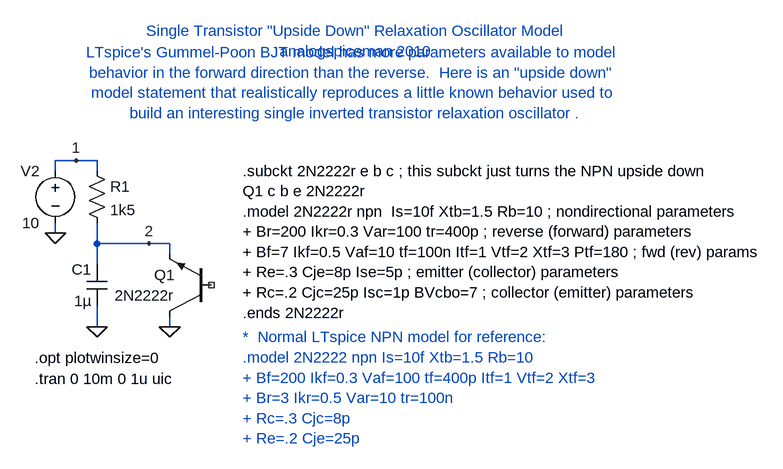
[diagram p0: schematic UpsideDown.asc]
UpsideDown.asc, the LTspice schematic file:
Version 4
SHEET 1 1064 680
WIRE -96 -384 -128 -384
WIRE -64 -384 -96 -384
WIRE -128 -368 -128 -384
WIRE -64 -368 -64 -384
WIRE -128 -272 -128 -288
WIRE -64 -256 -64 -288
WIRE 16 -256 -64 -256
WIRE 48 -256 16 -256
WIRE 48 -240 48 -256
WIRE -64 -224 -64 -256
WIRE -64 -128 -64 -160
WIRE 48 -128 48 -144
FLAG 48 -128 0
FLAG -64 -128 0
FLAG -128 -272 0
FLAG -96 -384 1
FLAG 16 -256 2
SYMBOL npn 112 -144 R180
WINDOW 0 56 64 Left 0
WINDOW 3 56 32 Left 0
SYMATTR InstName Q1
SYMATTR Value 2N2222r
SYMATTR Prefix X
SYMBOL res -80 -384 R0
SYMATTR InstName R1
SYMATTR Value 1k5
SYMBOL cap -48 -224 M0
SYMATTR InstName C1
SYMATTR Value 1µ
SYMATTR SpiceLine V=50 Irms=0 Rser=0.008 Lser=0 mfg="TDK" pn="C3225X7RlHlO5M" type="X7R"
SYMBOL voltage -128 -384 M0
WINDOW 123 0 0 Left 0
WINDOW 39 0 0 Left 0
SYMATTR InstName V2
SYMATTR Value 10
TEXT -160 -80 Left 0 !.opt plotwinsize=0
TEXT -160 -48 Left 0 !.tran 0 10m 0 1u uic
TEXT 160 -112 Left 0 ;*  Normal LTspice NPN model for reference:\n.model 2N2222 npn Is=10f Xtb=1.5 Rb=10\n+ Bf=200 Ikf=0.3 Vaf=100 tf=400p Itf=1 Vtf=2 Xtf=3\n+ Br=3 Ikr=0.5 Var=10 tr=100n\n+ Rc=.3 Cjc=8p\n+ Re=.2 Cje=25p
TEXT 160 -368 Left 0 !.subckt 2N2222r e b c ; this subckt just turns the NPN upside down\nQ1 c b e 2N2222r\n.model 2N2222r npn  Is=10f Xtb=1.5 Rb=10 ; nondirectional parameters\n+ Br=200 Ikr=0.3 Var=100 tr=400p ; reverse (forward) parameters\n+ Bf=7 Ikf=0.5 Vaf=10 tf=100n Itf=1 Vtf=2 Xtf=3 Ptf=180 ; fwd (rev) params\n+ Re=.3 Cje=8p Ise=5p ; emitter (collector) parameters\n+ Rc=.2 Cjc=25p Isc=1p BVcbo=7 ; collector (emitter) parameters\n.ends 2N2222r
TEXT 336 -568 Center 0 ;Single Transistor "Upside Down" Relaxation Oscillator Model\nanalogspiceman 2010
TEXT 336 -504 Center 0 ;LTspice's Gummel-Poon BJT model has more parameters available to model \nbehavior in the forward direction than the reverse.  Here is an "upside down" \nmodel statement that realistically reproduces a little known behavior used to \nbuild an interesting single inverted transistor relaxation oscillator .

The netlist it stands for:
* UpsideDown.asc
XQ1 0 NC_01 2 2N2222r  ; pins C B E
R1 1 2 1k5
C1 2 0 1µ V=50 Irms=0 Rser=0.008 Lser=0 mfg="TDK" pn="C3225X7RlHlO5M" type="X7R"
V2 1 0 10
.opt plotwinsize=0
.tran 0 10m 0 1u uic
* *  Normal LTspice NPN model for reference:
* .model 2N2222 npn Is=10f Xtb=1.5 Rb=10
* + Bf=200 Ikf=0.3 Vaf=100 tf=400p Itf=1 Vtf=2 Xtf=3
* + Br=3 Ikr=0.5 Var=10 tr=100n
* + Rc=.3 Cjc=8p
* + Re=.2 Cje=25p
.subckt 2N2222r e b c ; this subckt just turns the NPN upside down
Q1 c b e 2N2222r
.model 2N2222r npn  Is=10f Xtb=1.5 Rb=10 ; nondirectional parameters
+ Br=200 Ikr=0.3 Var=100 tr=400p ; reverse (forward) parameters
+ Bf=7 Ikf=0.5 Vaf=10 tf=100n Itf=1 Vtf=2 Xtf=3 Ptf=180 ; fwd (rev) params
+ Re=.3 Cje=8p Ise=5p ; emitter (collector) parameters
+ Rc=.2 Cjc=25p Isc=1p BVcbo=7 ; collector (emitter) parameters
.ends 2N2222r
* Single Transistor "Upside Down" Relaxation Oscillator Model
* analogspiceman 2010
* LTspice's Gummel-Poon BJT model has more parameters available to model
* behavior in the forward direction than the reverse.  Here is an "upside down"
* model statement that realistically reproduces a little known behavior used to
* build an interesting single inverted transistor relaxation oscillator .
.backanno
.end